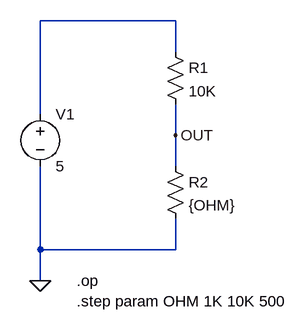
[diagram p0: schematic Resistor_Variable2.asc]
Resistor_Variable2.asc, the LTspice schematic file:
Version 4.1
SHEET 1 6036 836
WIRE 1376 -160 1168 -160
WIRE 1376 -112 1376 -160
WIRE 1168 -16 1168 -160
WIRE 1376 16 1376 -32
WIRE 1376 64 1376 16
WIRE 1168 192 1168 64
WIRE 1376 192 1376 144
WIRE 1376 192 1168 192
WIRE 1168 240 1168 192
FLAG 1168 240 0
FLAG 1376 16 OUT
SYMBOL voltage 1168 -32 R0
WINDOW 123 0 0 Left 0
WINDOW 39 0 0 Left 0
SYMATTR InstName V1
SYMATTR Value 5
SYMBOL res 1360 -128 R0
SYMATTR InstName R1
SYMATTR Value 10K
SYMBOL res 1360 48 R0
SYMATTR InstName R2
SYMATTR Value {OHM}
TEXT 1224 240 Left 2 !.op\n.step param OHM 1K 10K 500

The netlist it stands for:
* Resistor_Variable2.asc
V1 N001 0 5
R1 N001 OUT 10K
R2 OUT 0 {OHM}
.op
.step param OHM 1K 10K 500
.backanno
.end